# EAGLE schematic controller_v3 (EAGLE 9.7.0)
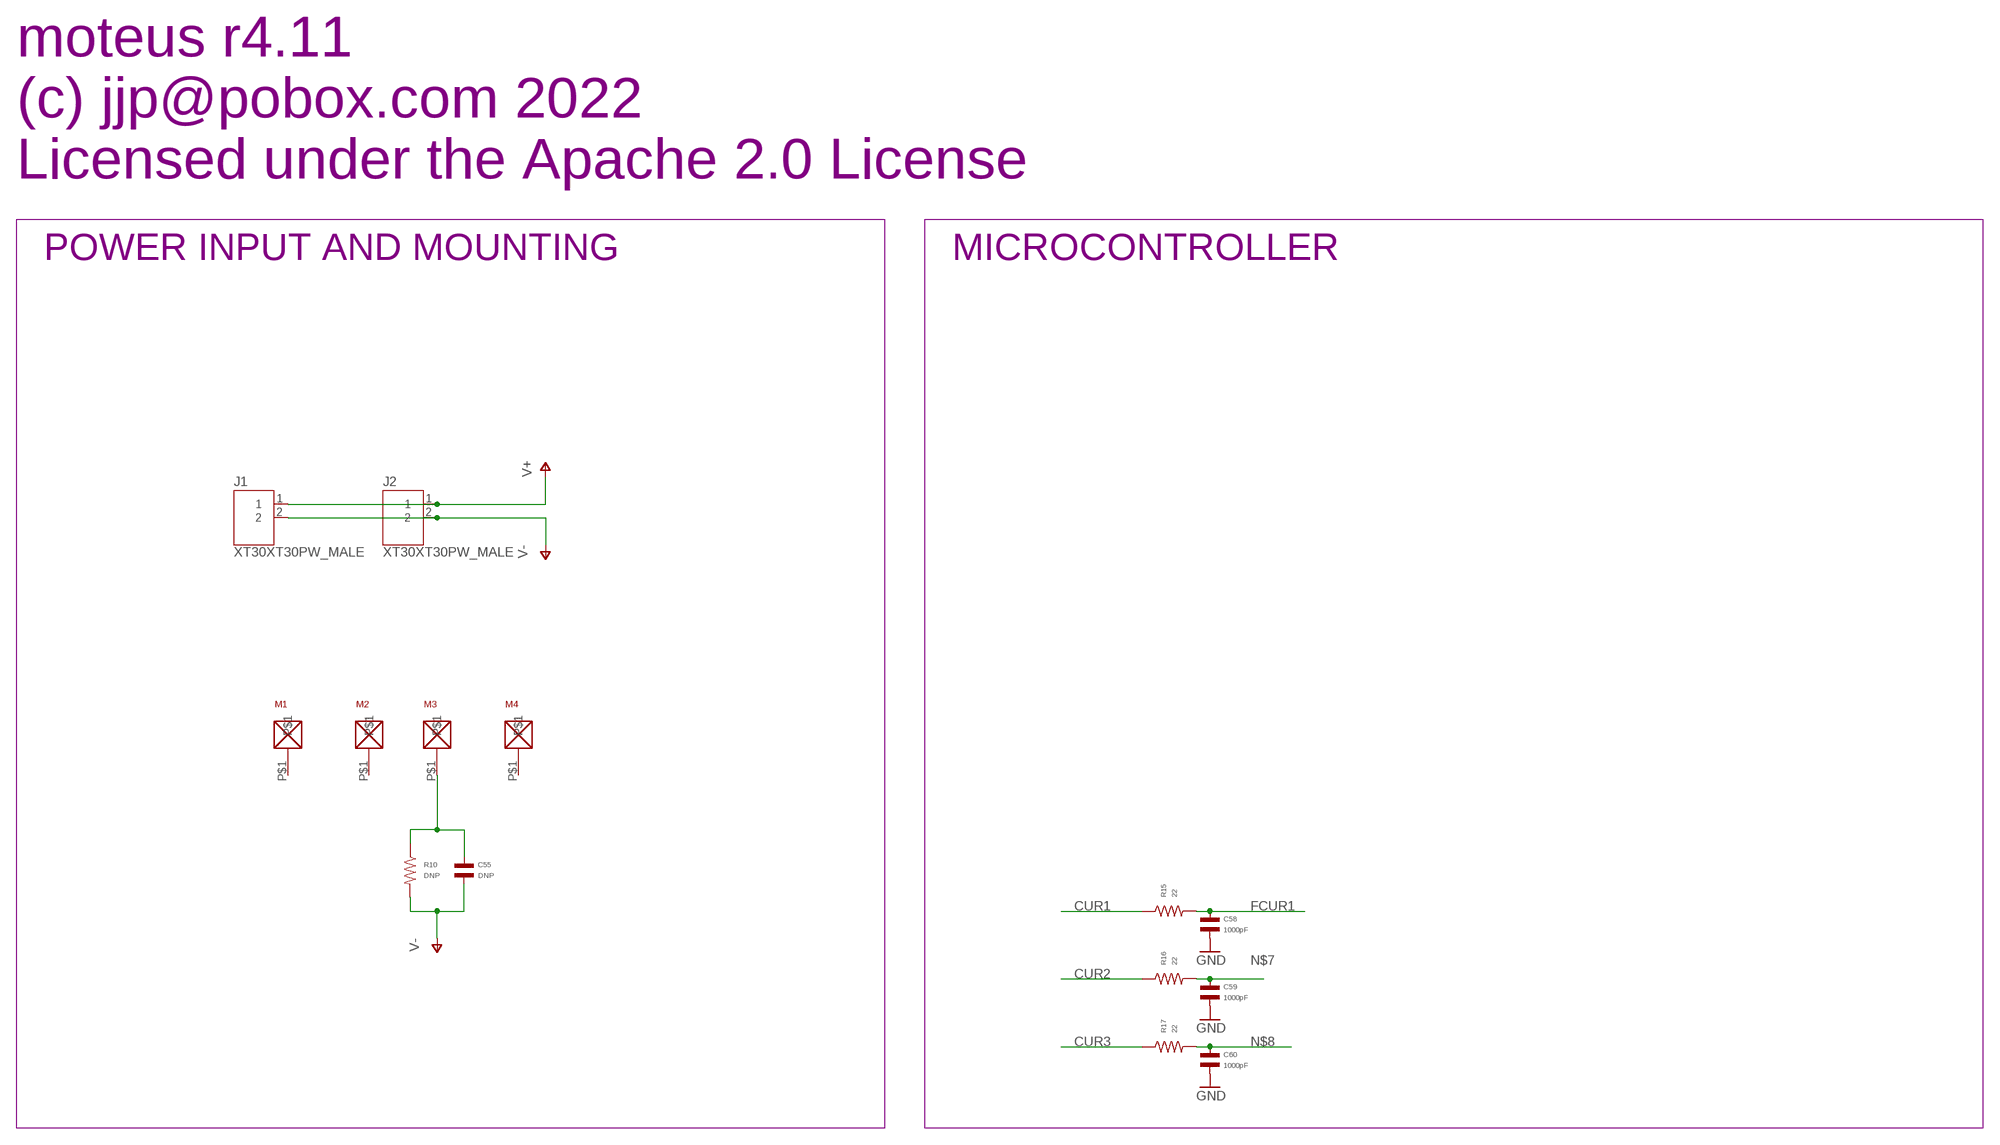
[diagram p0: schematic, sheet 1, part 1 of 3]
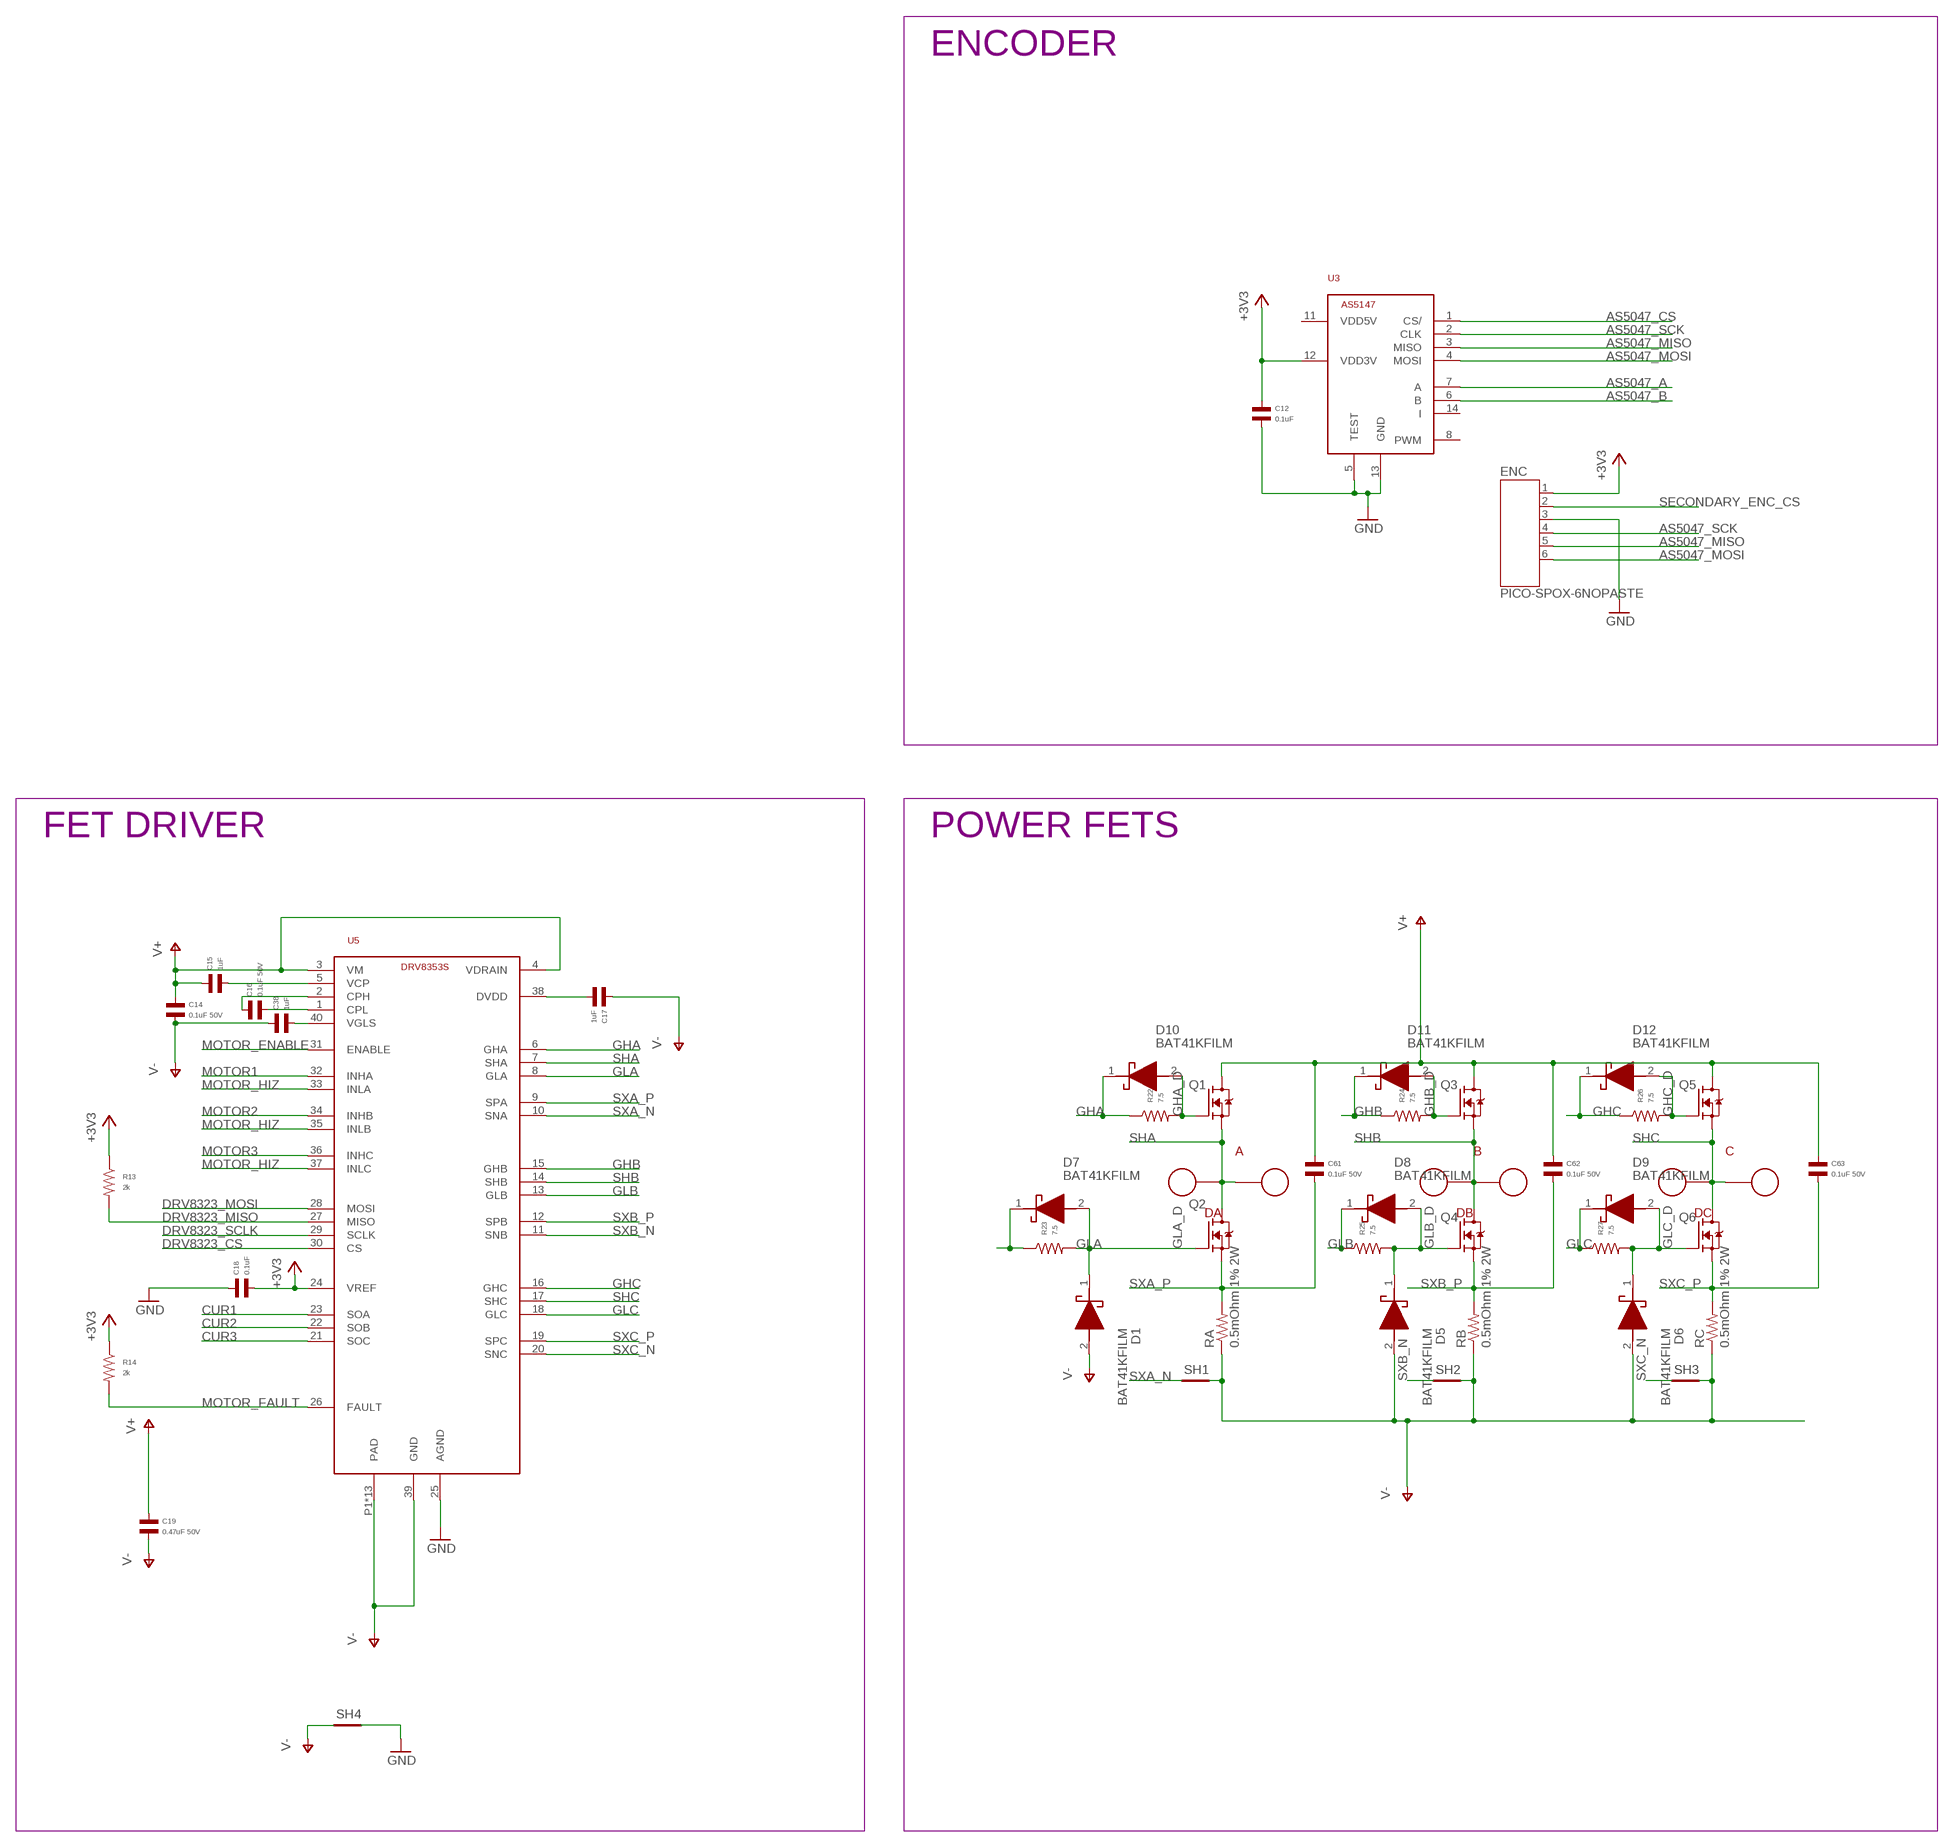
[diagram p1: schematic, sheet 1, part 2 of 3]
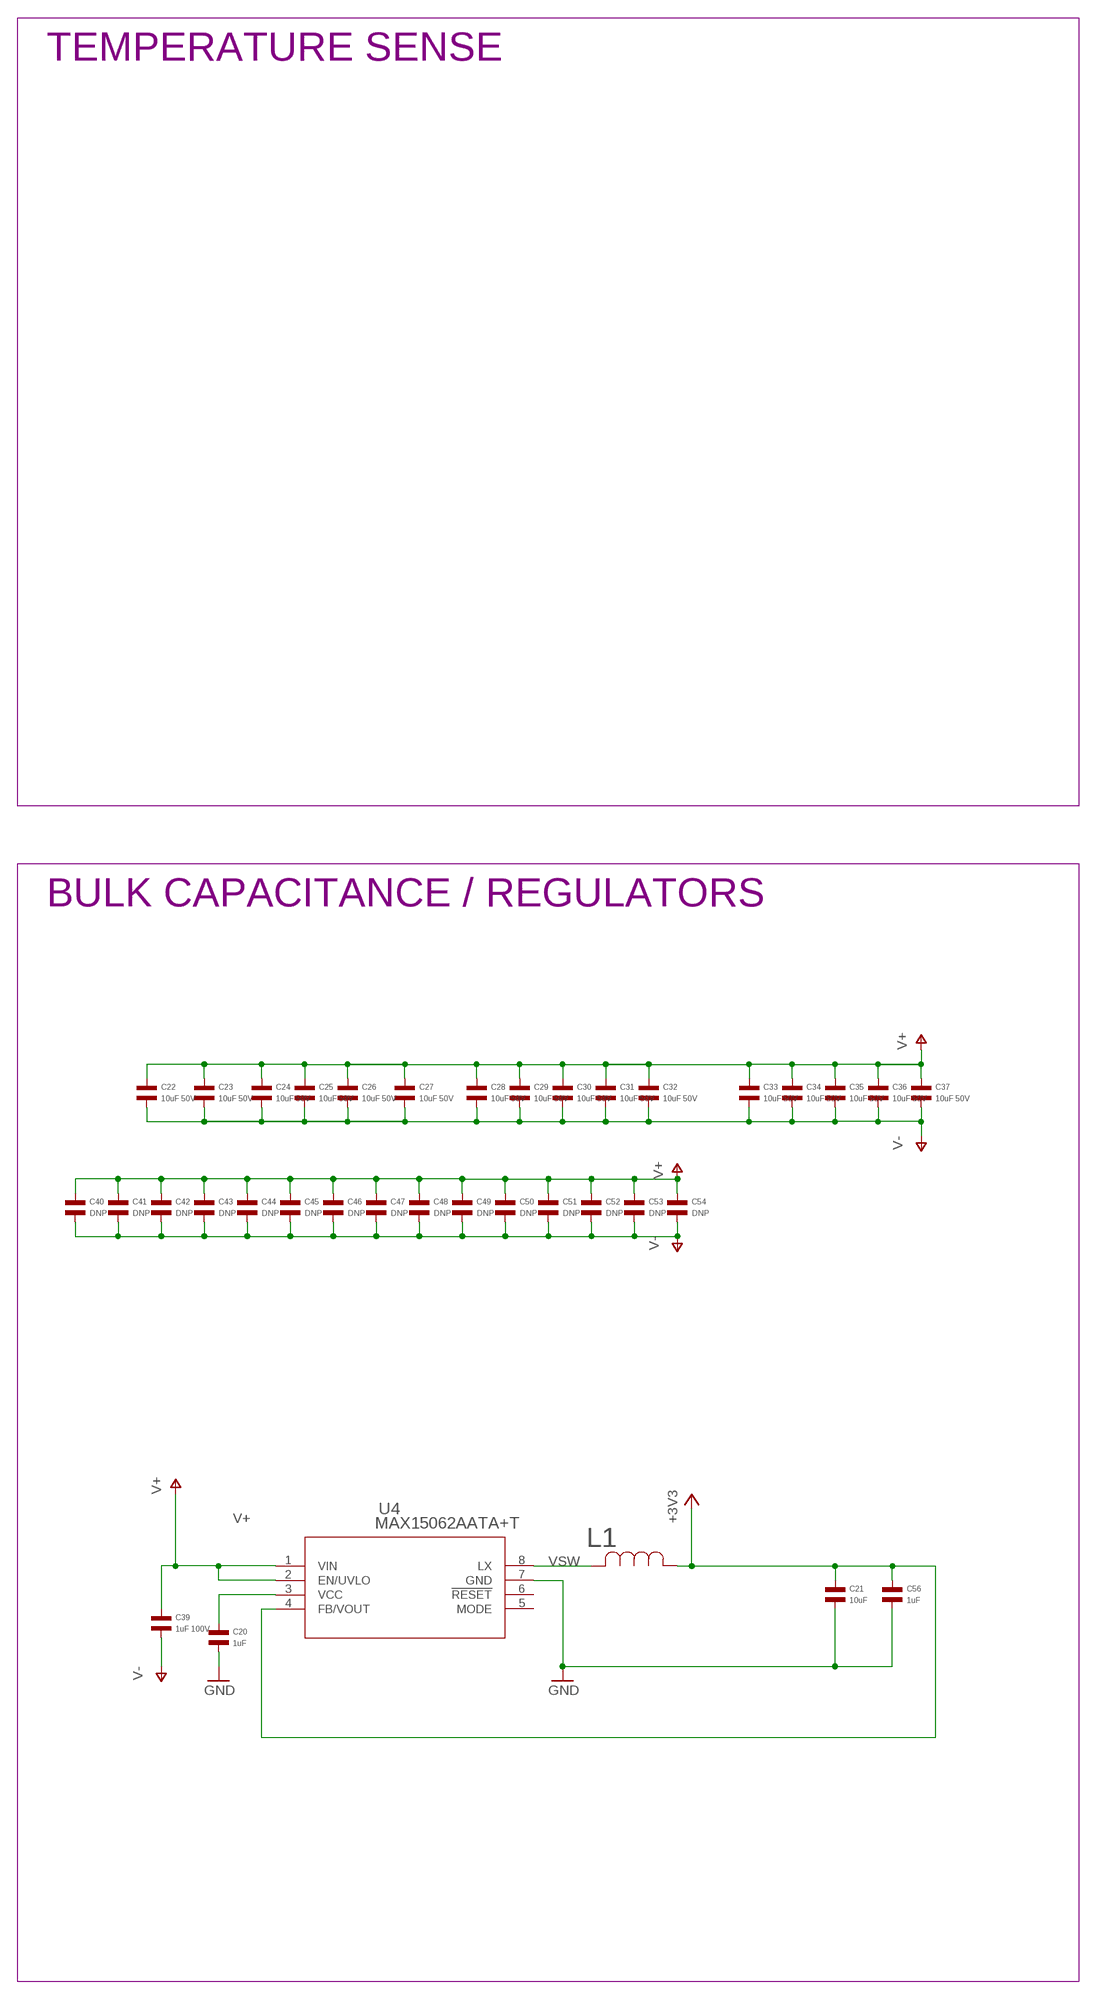
[diagram p2: schematic, sheet 1, part 3 of 3]

## Parts
A  PAD16AWG_PAD  [16AWG_PAD]
B  PAD16AWG_PAD  [16AWG_PAD]
C  PAD16AWG_PAD  [16AWG_PAD]
C12  0.1uF  CAPACITOR_NP_0402  [C0402]
C14  0.1uF 50V  CAPACITOR_NP_0402  [C0402]
C15  1uF  CAPACITOR_NP_0402  [C0402]
C16  0.1uF 50V  CAPACITOR_NP_0402  [C0402]
C17  1uF  CAPACITOR_NP_0402  [C0402]
C18  0.1uF  CAPACITOR_NP_0402  [C0402]
C19  0.47uF 50V  CAPACITOR_NP_0402  [C0402]
C20  1uF  CAPACITOR_NP_0603  [C0603]
C21  10uF  CAPACITOR_NP_1206  [C1206]
C22  10uF 50V  CAPACITOR_NP_1206  [C1206]
C23  10uF 50V  CAPACITOR_NP_1206  [C1206]
C24  10uF 50V  CAPACITOR_NP_1206  [C1206]
C25  10uF 50V  CAPACITOR_NP_1206  [C1206]
C26  10uF 50V  CAPACITOR_NP_1206  [C1206]
C27  10uF 50V  CAPACITOR_NP_1206  [C1206]
C28  10uF 50V  CAPACITOR_NP_1206  [C1206]
C29  10uF 50V  CAPACITOR_NP_1206  [C1206]
C30  10uF 50V  CAPACITOR_NP_1206  [C1206]
C31  10uF 50V  CAPACITOR_NP_1206  [C1206]
C32  10uF 50V  CAPACITOR_NP_1206  [C1206]
C33  10uF 50V  CAPACITOR_NP_1206  [C1206]
C34  10uF 50V  CAPACITOR_NP_1206  [C1206]
C35  10uF 50V  CAPACITOR_NP_1206_NOBORDER  [C1206_NOBORDER]
C36  10uF 50V  CAPACITOR_NP_1206  [C1206]
C37  10uF 50V  CAPACITOR_NP_1206  [C1206]
C38  1uF  CAPACITOR_NP_0603  [C0603]
C39  1uF 100V  CAPACITOR_NP_0805  [C0805]
C40  DNP  CAPACITOR_NP_1206_NOCREAM  [C1206_NOCREAM]
C41  DNP  CAPACITOR_NP_1206_NOCREAM  [C1206_NOCREAM]
C42  DNP  CAPACITOR_NP_1206_NOCREAM  [C1206_NOCREAM]
C43  DNP  CAPACITOR_NP_1206_NOCREAM  [C1206_NOCREAM]
C44  DNP  CAPACITOR_NP_1206_NOCREAM  [C1206_NOCREAM]
C45  DNP  CAPACITOR_NP_1206_NOCREAM  [C1206_NOCREAM]
C46  DNP  CAPACITOR_NP_1206_NOCREAM  [C1206_NOCREAM]
C47  DNP  CAPACITOR_NP_1206_NOCREAM  [C1206_NOCREAM]
C48  DNP  CAPACITOR_NP_1206_NOCREAM  [C1206_NOCREAM]
C49  DNP  CAPACITOR_NP_1206_NOCREAM  [C1206_NOCREAM]
C50  DNP  CAPACITOR_NP_1206_NOCREAM  [C1206_NOCREAM]
C51  DNP  CAPACITOR_NP_1206_NOCREAM  [C1206_NOCREAM]
C52  DNP  CAPACITOR_NP_1206_NOCREAM  [C1206_NOCREAM]
C53  DNP  CAPACITOR_NP_1206_NOCREAM  [C1206_NOCREAM]
C54  DNP  CAPACITOR_NP_1206_NOCREAM  [C1206_NOCREAM]
C55  DNP  CAPACITOR_NP_0402  [C0402]
C56  1uF  CAPACITOR_NP_0402  [C0402]
C58  1000pF  CAPACITOR_NP_0402_NOBORDER  [C0402_NOBORDER]
C59  1000pF  CAPACITOR_NP_0402_NOBORDER  [C0402_NOBORDER]
C60  1000pF  CAPACITOR_NP_0402_NOBORDER  [C0402_NOBORDER]
C61  0.1uF 50V  CAPACITOR_NP_1206  [C1206]
C62  0.1uF 50V  CAPACITOR_NP_0603_NOBORDER  [C0603_NOBORDER]
C63  0.1uF 50V  CAPACITOR_NP_1206  [C1206]
D1  BAT41KFILM  [SODFL1608X70N]
D5  BAT41KFILM  [SODFL1608X70N]
D6  BAT41KFILM  [SODFL1608X70N]
D7  BAT41KFILM  [SODFL1608X70N]
D8  BAT41KFILM  [SODFL1608X70N]
D9  BAT41KFILM  [SODFL1608X70N]
D10  BAT41KFILM  [SODFL1608X70N]
D11  BAT41KFILM  [SODFL1608X70N]
D12  BAT41KFILM  [SODFL1608X70N]
DA  PAD24AWG_PAD  [24AWG_PAD]
DB  PAD24AWG_PAD  [24AWG_PAD]
DC  PAD24AWG_PAD  [24AWG_PAD]
ENC  PICO-SPOX-6NOPASTE  [PICO-SPOX-SMT-RA-6-NOPASTE]
J1  XT30XT30PW_MALE  [XT30PW_MALE]
J2  XT30XT30PW_MALE  [XT30PW_MALE]
L1  SRN4018-220M  [IND_BOURNS_SRN4018]
M1  MOUNT  [M2.5MOUNT]
M2  MOUNT  [M2.5MOUNT]
M3  MOUNT  [M2.5MOUNT]
M4  MOUNT  [M2.5MOUNT]
Q1  TPH1R204PLSOP_ADVANCE_8  [SOP_ADVANCE_8]
Q2  TPH1R204PLSOP_ADVANCE_8  [SOP_ADVANCE_8]
Q3  TPH1R204PLSOP_ADVANCE_8  [SOP_ADVANCE_8]
Q4  TPH1R204PLSOP_ADVANCE_8  [SOP_ADVANCE_8]
Q5  TPH1R204PLSOP_ADVANCE_8  [SOP_ADVANCE_8]
Q6  TPH1R204PLSOP_ADVANCE_8  [SOP_ADVANCE_8]
R10  DNP  RESISTOR_0402  [R0402]
R13  2k  RESISTOR_0402  [R0402]
R14  2k  RESISTOR_0402  [R0402]
R15  22  RESISTOR_0402_NOBORDER  [R0402_NOBORDER]
R16  22  RESISTOR_0402_NOBORDER  [R0402_NOBORDER]
R17  22  RESISTOR_0402_NOBORDER  [R0402_NOBORDER]
R22  7.5  RESISTOR_0402  [R0402]
R23  7.5  RESISTOR_0402  [R0402]
R24  7.5  RESISTOR_0402  [R0402]
R25  7.5  RESISTOR_0402  [R0402]
R26  7.5  RESISTOR_0402  [R0402]
R27  7.5  RESISTOR_0402  [R0402]
RA  0.5mOhm 1% 2W  R-US_M1206  [M1206]
RB  0.5mOhm 1% 2W  R-US_M1206  [M1206]
RC  0.5mOhm 1% 2W  R-US_M1206  [M1206]
SH1  SHORTT5  [SHORT_TOP-50]
SH2  SHORTT5  [SHORT_TOP-50]
SH3  SHORTT5  [SHORT_TOP-50]
SH4  SHORTMEDIUM  [SHORT_TOP-MEDIUM]
U3  AS5147  [TSSOP14]
U4  MAX15062AATA+T  [21-0487A_MXM]
U5  DRV8353S  [WQFN-40]

## Nets
+3V3: C12.P$1 C18.P$2 C21.P$1 C56.P$1 ENC.1 L1.1 R13.P$1 R14.P$1 U3.12(VDD3V) U4.4(FB/VOUT) U5.24(VREF)
AS5047_A: U3.7(A)
AS5047_B: U3.6(B)
AS5047_CS: U3.1(CS/)
AS5047_MISO: ENC.5 U3.3(MISO)
AS5047_MOSI: ENC.6 U3.4(MOSI)
AS5047_SCK: ENC.4 U3.2(CLK)
CUR1: R15.P$1 U5.23(SOA)
CUR2: R16.P$1 U5.22(SOB)
CUR3: R17.P$1 U5.21(SOC)
DRV8323_CS: U5.30(CS)
DRV8323_MISO: R13.P$2 U5.27(MISO)
DRV8323_MOSI: U5.28(MOSI)
DRV8323_SCLK: U5.29(SCLK)
FCUR1: C58.P$1 R15.P$2
GHA: D10.1(K) R22.P$1 U5.6(GHA)
GHA_D: D10.2(A) Q1.4(G) R22.P$2
GHB: D11.1(K) R24.P$1 U5.15(GHB)
GHB_D: D11.2(A) Q3.4(G) R24.P$2
GHC: D12.1(K) R26.P$1 U5.16(GHC)
GHC_D: D12.2(A) Q5.4(G) R26.P$2
GLA: D7.1(K) R23.P$1 U5.8(GLA)
GLA_D: D1.1(K) D7.2(A) Q2.4(G) R23.P$2
GLB: D8.1(K) R25.P$1 U5.13(GLB)
GLB_D: D5.1(K) D8.2(A) Q4.4(G) R25.P$2
GLC: D9.1(K) R27.P$1 U5.18(GLC)
GLC_D: D6.1(K) D9.2(A) Q6.4(G) R27.P$2
GND: C12.P$2 C18.P$1 C20.P$2 C21.P$2 C56.P$2 C58.P$2 C59.P$2 C60.P$2 ENC.3 SH4.2 U3.5(TEST) U3.13(GND) U4.7(GND) U5.25(AGND)
MOTOR1: U5.32(INHA)
MOTOR2: U5.34(INHB)
MOTOR3: U5.36(INHC)
MOTOR_ENABLE: U5.31(ENABLE)
MOTOR_FAULT: R14.P$2 U5.26(FAULT)
MOTOR_HIZ: U5.33(INLA) U5.35(INLB) U5.37(INLC)
N$1: C55.P$1 M3.P$1 R10.P$1
N$2: C38.P$2 U5.40(VGLS)
N$4: C20.P$1 U4.3(VCC)
N$7: C59.P$1 R16.P$2
N$8: C60.P$1 R17.P$2
N$10: C16.P$2 U5.1(CPL)
N$13: C16.P$1 U5.2(CPH)
N$14: C15.P$2 U5.5(VCP)
N$16: C17.P$2 U5.38(DVDD)
SECONDARY_ENC_CS: ENC.2
SHA: A.1 DA.P$1 Q1.1(S) Q1.2(S) Q1.3(S) Q2.5(D) Q2.6(D) Q2.7(D) Q2.8(D) Q2.PAD(D) U5.7(SHA)
SHB: B.1 DB.P$1 Q3.1(S) Q3.2(S) Q3.3(S) Q4.5(D) Q4.6(D) Q4.7(D) Q4.8(D) Q4.PAD(D) U5.14(SHB)
SHC: C.1 DC.P$1 Q5.1(S) Q5.2(S) Q5.3(S) Q6.5(D) Q6.6(D) Q6.7(D) Q6.8(D) Q6.PAD(D) U5.17(SHC)
SXA_N: SH1.1 U5.10(SNA)
SXA_P: C61.P$2 Q2.1(S) Q2.2(S) Q2.3(S) RA.2 U5.9(SPA)
SXB_N: SH2.1 U5.11(SNB)
SXB_P: C62.P$2 Q4.1(S) Q4.2(S) Q4.3(S) RB.2 U5.12(SPB)
SXC_N: SH3.1 U5.20(SNC)
SXC_P: C63.P$2 Q6.1(S) Q6.2(S) Q6.3(S) RC.2 U5.19(SPC)
V+: C14.P$1 C15.P$1 C19.P$1 C22.P$1 C23.P$1 C24.P$1 C25.P$1 C26.P$1 C27.P$1 C28.P$1 C29.P$1 C30.P$1 C31.P$1 C32.P$1 C33.P$1 C34.P$1 C35.P$1 C36.P$1 C37.P$1 C39.P$1 C40.P$1 C41.P$1 C42.P$1 C43.P$1 C44.P$1 C45.P$1 C46.P$1 C47.P$1 C48.P$1 C49.P$1 C50.P$1 C51.P$1 C52.P$1 C53.P$1 C54.P$1 C61.P$1 C62.P$1 C63.P$1 J1.1 J2.1 Q1.5(D) Q1.6(D) Q1.7(D) Q1.8(D) Q1.PAD(D) Q3.5(D) Q3.6(D) Q3.7(D) Q3.8(D) Q3.PAD(D) Q5.5(D) Q5.6(D) Q5.7(D) Q5.8(D) Q5.PAD(D) U4.1(VIN) U4.2(EN/UVLO) U5.3(VM) U5.4(VDRAIN)
V-: C14.P$2 C17.P$1 C19.P$2 C22.P$2 C23.P$2 C24.P$2 C25.P$2 C26.P$2 C27.P$2 C28.P$2 C29.P$2 C30.P$2 C31.P$2 C32.P$2 C33.P$2 C34.P$2 C35.P$2 C36.P$2 C37.P$2 C38.P$1 C39.P$2 C40.P$2 C41.P$2 C42.P$2 C43.P$2 C44.P$2 C45.P$2 C46.P$2 C47.P$2 C48.P$2 C49.P$2 C50.P$2 C51.P$2 C52.P$2 C53.P$2 C54.P$2 C55.P$2 D1.2(A) D5.2(A) D6.2(A) J1.2 J2.2 R10.P$2 RA.1 RB.1 RC.1 SH1.2 SH2.2 SH3.2 SH4.1 U5.39(GND) U5.P1(PAD) U5.P2(PAD) U5.P3(PAD) U5.P7(PAD) U5.P8(PAD) U5.P9(PAD) U5.P12(PAD) U5.P13(PAD) U5.P14(PAD) U5.P17(PAD) U5.P18(PAD) U5.P19(PAD) U5.PAD
VSW: L1.2 U4.8(LX)
Unconnected: M1.P$1 M2.P$1 M4.P$1 U3.8(PWM) U3.11(VDD5V) U3.14(I) U4.5(MODE) U4.6(!RESET)

## Notes on the sheet
- moteus r4.11
  (c) jjp@pobox.com 2022
  Licensed under the Apache 2.0 License
- POWER INPUT AND MOUNTING | MICROCONTROLLER
- ENCODER | TEMPERATURE SENSE
- FET DRIVER | POWER FETS | BULK CAPACITANCE / REGULATORS

## Library data of the parts
A B C DA DB DC = controller:PAD; POPULATE: 0
C12 C18 = mfpassives:CAPACITOR_NP: Library: MF_Passives Description: Device for Non-Polarized Capacitors. Manufacture part number (MPN) can be added via Attributes. Check https://factory.macrofab.com/parts for the house parts list.; HOUSEPART: YES; MPN: MF-CAP-0402-0.1uF; POPULATE: 1
C14 C16 = mfpassives:CAPACITOR_NP: Library: MF_Passives Description: Device for Non-Polarized Capacitors. Manufacture part number (MPN) can be added via Attributes. Check https://factory.macrofab.com/parts for the house parts list.; MF: TDK; MPN: CGA2B3X7R1H104K050BB; POPULATE: 1
C15 C17 C56 = mfpassives:CAPACITOR_NP: Library: MF_Passives Description: Device for Non-Polarized Capacitors. Manufacture part number (MPN) can be added via Attributes. Check https://factory.macrofab.com/parts for the house parts list.; HOUSEPART: YES; MPN: MF-CAP-0402-1uF; POPULATE: 1
C19 = mfpassives:CAPACITOR_NP: Library: MF_Passives Description: Device for Non-Polarized Capacitors. Manufacture part number (MPN) can be added via Attributes. Check https://factory.macrofab.com/parts for the house parts list.; MF: Murata; MPN: GRM155R61H474KE11D; POPULATE: 1
C20 = mfpassives:CAPACITOR_NP: Library: MF_Passives Description: Device for Non-Polarized Capacitors. Manufacture part number (MPN) can be added via Attributes. Check https://factory.macrofab.com/parts for the house parts list.; HOUSEPART: 1; MPN: MF-CAP-0603-1uF; POPULATE: 1
C21 = mfpassives:CAPACITOR_NP: Library: MF_Passives Description: Device for Non-Polarized Capacitors. Manufacture part number (MPN) can be added via Attributes. Check https://factory.macrofab.com/parts for the house parts list.; HOUSEPART: 1; MPN: MF-CAP-1206-10uF; POPULATE: 1
C22-C34 C36 C37 = mfpassives:CAPACITOR_NP: Library: MF_Passives Description: Device for Non-Polarized Capacitors. Manufacture part number (MPN) can be added via Attributes. Check https://factory.macrofab.com/parts for the house parts list.; MF: TDK; MPN: C3216X7R1H106K160AE; POPULATE: 1
C35 = controller:CAPACITOR_NP: Library: MF_Passives Description: Device for Non-Polarized Capacitors. Manufacture part number (MPN) can be added via Attributes. Check https://factory.macrofab.com/parts for the house parts list.; MF: TDK; MPN: C3216X7R1H106K160AE; POPULATE: 1
C38 = mfpassives:CAPACITOR_NP: Library: MF_Passives Description: Device for Non-Polarized Capacitors. Manufacture part number (MPN) can be added via Attributes. Check https://factory.macrofab.com/parts for the house parts list.; HOUSEPART: YES; MF: TDK; MPN: C1608X7R1E105K080AE; POPULATE: 1
C39 = mfpassives:CAPACITOR_NP: Library: MF_Passives Description: Device for Non-Polarized Capacitors. Manufacture part number (MPN) can be added via Attributes. Check https://factory.macrofab.com/parts for the house parts list.; MF: MURATA; MPN: GCM21BC72A105KE36L; POPULATE: 1
C40-C54 = controller:CAPACITOR_NP: Library: MF_Passives Description: Device for Non-Polarized Capacitors. Manufacture part number (MPN) can be added via Attributes. Check https://factory.macrofab.com/parts for the house parts list.; POPULATE: 0
C55 = mfpassives:CAPACITOR_NP: Library: MF_Passives Description: Device for Non-Polarized Capacitors. Manufacture part number (MPN) can be added via Attributes. Check https://factory.macrofab.com/parts for the house parts list.; POPULATE: 0
C58-C60 = controller:CAPACITOR_NP: Library: MF_Passives Description: Device for Non-Polarized Capacitors. Manufacture part number (MPN) can be added via Attributes. Check https://factory.macrofab.com/parts for the house parts list.; HOUSEPART: 1; MPN: MF-CAP-0402-1nF; POPULATE: 1
C61 C63 = mfpassives:CAPACITOR_NP: Library: MF_Passives Description: Device for Non-Polarized Capacitors. Manufacture part number (MPN) can be added via Attributes. Check https://factory.macrofab.com/parts for the house parts list.; MF: KYOCERA AVX; MPN: 12065C104KAZ2A; POPULATE: 1
C62 = controller:CAPACITOR_NP: Library: MF_Passives Description: Device for Non-Polarized Capacitors. Manufacture part number (MPN) can be added via Attributes. Check https://factory.macrofab.com/parts for the house parts list.; MF: KYOCERA AVX; MPN: 06035C104KAZ2A; POPULATE: 1
D1 D5-D12 = BAT41KFILM:BAT41KFILM: STMicroelectronics 100V 200mA, Diode, 2-Pin SOD-523 BAT41KFILM Source: Datasheet <https://www.st.com/resource/en/datasheet/bat41.pdf>; DESCRIPTION: STMicroelectronics 100V 200mA, Diode, 2-Pin SOD-523 BAT41KFILM; HEIGHT: 0.7mm; MANUFACTURER_NAME: STMicroelectronics; MANUFACTURER_PART_NUMBER: BAT41KFILM; MF: ST; MOUSER_PART_NUMBER: 511-BAT41KFILM; MOUSER_PRICE-STOCK: https://www.mouser.co.uk/ProductDetail/STMicroelectronics/BAT41KFILM?qs=jZi1jxfVU94ZzsUNeiIqGg%3D%3D; MPN: BAT41KFILM; POPULATE: 1
ENC = controller:PICO-SPOX-6; POPULATE: 0
J1 J2 = controller:XT30; POPULATE: 1
L1 = controller:SRN4018-220M; ALT2_MF: WURTH; ALT2_MPN: 74404042330; ALT_MPN: SRN4026-330M; MANUFACTURER_PART_NUMBER: SRN4018-330M; MPN: SRN4018-330M; POPULATE: 1; VENDOR: Bourns Electronics
M1-M4 = controller:MOUNT; POPULATE: 0
Q1-Q6 = controller:TPH1R204PL; MF: Toshiba; MPN: TPH2R506PL,L1Q; POPULATE: 1
R10 = mfpassives:RESISTOR: Library: MF_Passives Description: Device for Resistors. Manufacture part number (MPN), Voltage, Tolerance, and Wattage Rating can be added via Attributes. Check https://factory.macrofab.com/parts for the house parts list.; POPULATE: 0
R13 R14 = mfpassives:RESISTOR: Library: MF_Passives Description: Device for Resistors. Manufacture part number (MPN), Voltage, Tolerance, and Wattage Rating can be added via Attributes. Check https://factory.macrofab.com/parts for the house parts list.; HOUSEPART: YES; MPN: MF-RES-0402-2K; POPULATE: 1
R15-R17 = controller:RESISTOR: Library: MF_Passives Description: Device for Resistors. Manufacture part number (MPN), Voltage, Tolerance, and Wattage Rating can be added via Attributes. Check https://factory.macrofab.com/parts for the house parts list.; HOUSEPART: 1; MPN: MF-RES-0402-22; POPULATE: 1
R22-R27 = mfpassives:RESISTOR: Library: MF_Passives Description: Device for Resistors. Manufacture part number (MPN), Voltage, Tolerance, and Wattage Rating can be added via Attributes. Check https://factory.macrofab.com/parts for the house parts list.; HOUSEPART: 1; MPN: RC0402FR-077R5L; POPULATE: 1
RA RB RC = rcl:R-US_: RESISTOR, American symbol; MF: Stackpole Electronics; MPN: HCS1206FTL500; POPULATE: 1
SH1-SH3 = shorts:SHORT: Short between two nets; BOM: no; POPULATE: 0
SH4 = shorts:SHORT: Short between two nets; POPULATE: 0
U3 = controller:AS5147; MF: AMS; MPN: AS5047P-ATSM; POPULATE: 1
U4 = power_dist:MAX15062AATA+T; BUILT_BY: EMA_Jessica; COPYRIGHT: Copyright (C) 2018 Accelerated Designs. All rights reserved; MANUFACTURER_PART_NUMBER: MAX15062AATA+T; MPN: MAX15062AATA+T; POPULATE: 1; REVISION: 1; SOURCELIBRARY: Maxim_DP_2018-06-12; VENDOR: Maxim Integrated Products
U5 = controller:DRV8353S; MF: TI; MPN: DRV8353FSRTAR; POPULATE: 1

## Net classes
0 default: width 0.127 mm
1 CAN: width 0.216 mm, clearance 0.127 mm